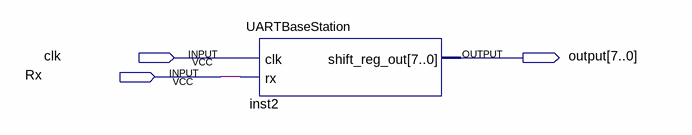
[diagram p0: schematic sheet]
// Quartus schematic BaseStaion.bdf as structural Verilog: 1 symbols, 3 pins
module BaseStaion (
  input  clk,
  input  Rx,
  output [7:0] \output 
);

  UARTBaseStation inst2 (.clk(clk), .rx(Rx), .shift_reg_out(\output ));
endmodule
